# EAGLE design Color sensor_Sensor Board (EAGLE 9.6.2)
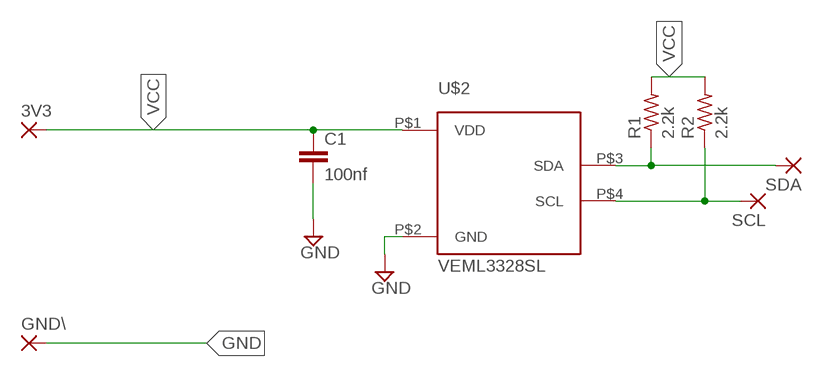
[diagram p0: schematic, sheet 1]

## Parts
3V3  SMD2  [SMD1,27-2,54]
C1  100nf  C-EUC0805  [C0805]
GND\  SMD2  [SMD1,27-2,54]
R1  2.2k  R-US_R0805  [R0805]
R2  2.2k  R-US_R0805  [R0805]
SCL  SMD2  [SMD1,27-2,54]
SDA  SMD2  [SMD1,27-2,54]
U$2  VEML3328SL  [OPLGA4SV]

## Nets
GND: C1.2 GND\.1(P) U$2.P$2(GND)
N$1: R1.1 SDA.1(P) U$2.P$3(SDA)
N$5: R2.1 SCL.1(P) U$2.P$4(SCL)
VCC: 3V3.1(P) C1.1 R1.2 R2.2 U$2.P$1(VDD)

## Library data of the parts
3V3 GND\ SCL SDA = wirepad:SMD2: SMD PAD
C1 = rcl:C-EU: CAPACITOR, European symbol; SPICEPREFIX: C
R1 R2 = rcl:R-US_: RESISTOR, American symbol; SPICEPREFIX: R
U$2 = VEML3328SL:VEML3328SL

## Board
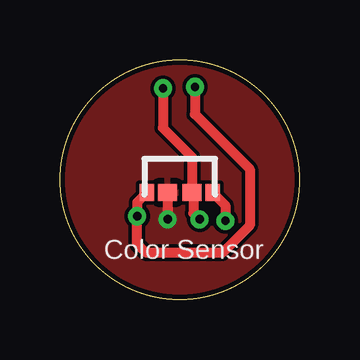
[diagram p1: board, top side]
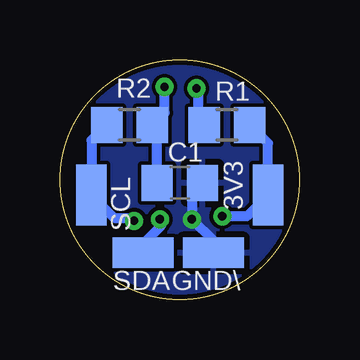
[diagram p2: board, bottom side, seen from below]

Size 10 x 10 mm. Coordinates in mm from the lower left corner, seen from the top.
Outline: circle at 5,5 radius 5
Copper layers (1*16): Top 0.035mm / dielectric 1.5mm / Bottom 0.035mm
Design rules "default *": minimum track width 6mil, minimum drill 0.35mm, track to track 6mil, track to pad 10mil, pad to pad 5mil, via to via 10mil, smd to smd 5mil, copper to edge 8mil, drill to drill 6mil, minimum pad ring 10mil, minimum via ring 8mil, stop-mask expansion 4mil, vias tented up to drill 0mil, thermal gap 10mil

### Footprints (pad centres in the part's own frame; a part is rotated, then mirrored left to right if it is on the bottom)
SMD1,27-2,54 = smd 1.27 x 2.54: 1 0,0
C0805 = smd 1.3 x 1.5: 1 -0.95,0; 2 0.95,0
R0805 = smd 1.3 x 1.5: 1 -0.95,0; 2 0.95,0
OPLGA4SV = smd 0.6 x 0.7: P$1 -1.37,0.1; P$4 1.37,0.1 | smd 0.8 x 0.7: P$2 -0.51,0.1; P$3 0.51,0.1

### Placement (x,y rotation side)
3V3  1.32,4.37 0 bottom
C1  5,4.87 0 bottom
GND\  3.6,1.95 90 bottom
R1  3.03,7.29 0 bottom
R2  7.1,7.29 0 bottom
SCL  8.68,4.37 180 bottom
SDA  6.52,1.95 90 bottom
U$2  5,4.37 0 top

### Tracks (layer width: path | path; a pad name or v marks a point on that pad's centre or on a via)
GND  (via drill 0.35)
  Top 0.406: U$2.P$2 v4.49,3.35
  Bottom 0.406: GND\.1 3.6,2.46 v4.49,3.35 4.49,4.43 C1.2
  pour Top: -0.71,9.32 -0.71,-0.59 10.91,-0.59 10.91,10.4 -0.71,10.4 -0.71,9.38
  pour Bottom: -0.71,10.27 -0.71,-0.52 10.91,-0.52 10.91,10.4 10.84,10.4 -0.71,10.4
N$1  (via drill 0.35)
  Top 0.406: v5.83,3.35 5.57,3.6 5.57,4.4 U$2.P$3 5.51,5.95 4.3,7.16 v4.3,8.81
  Bottom 0.406: SDA.1 6.52,2.33 5.76,3.09 5.76,3.29 v5.83,3.35 | R1.1 4.24,7.54 4.24,8.74 v4.3,8.81
N$5  (via drill 0.35)
  Top 0.406: U$2.P$4 6.91,3.93 v6.91,3.29
  Bottom 0.406: v6.91,3.29 7.03,3.41 7.73,3.41 SCL.1 8.68,6.65 R2.1
VCC  (via drill 0.35)
  Top 0.406: U$2.P$1 3.22,4.06 v3.22,3.48 3.22,2.33 3.6,1.95 6.78,1.95 7.92,3.09 7.92,5.45 5.63,7.73 v5.63,8.87
  Bottom 0.406: v3.22,3.48 2.21,3.48 3V3.1 1.32,6.52 R1.2 | C1.1 5.95,7.09 R2.2 5.63,7.8 v5.63,8.87

### Text on the board
tNames: Color Sensor